# Altium project unisat_obc_hw.PrjPCB
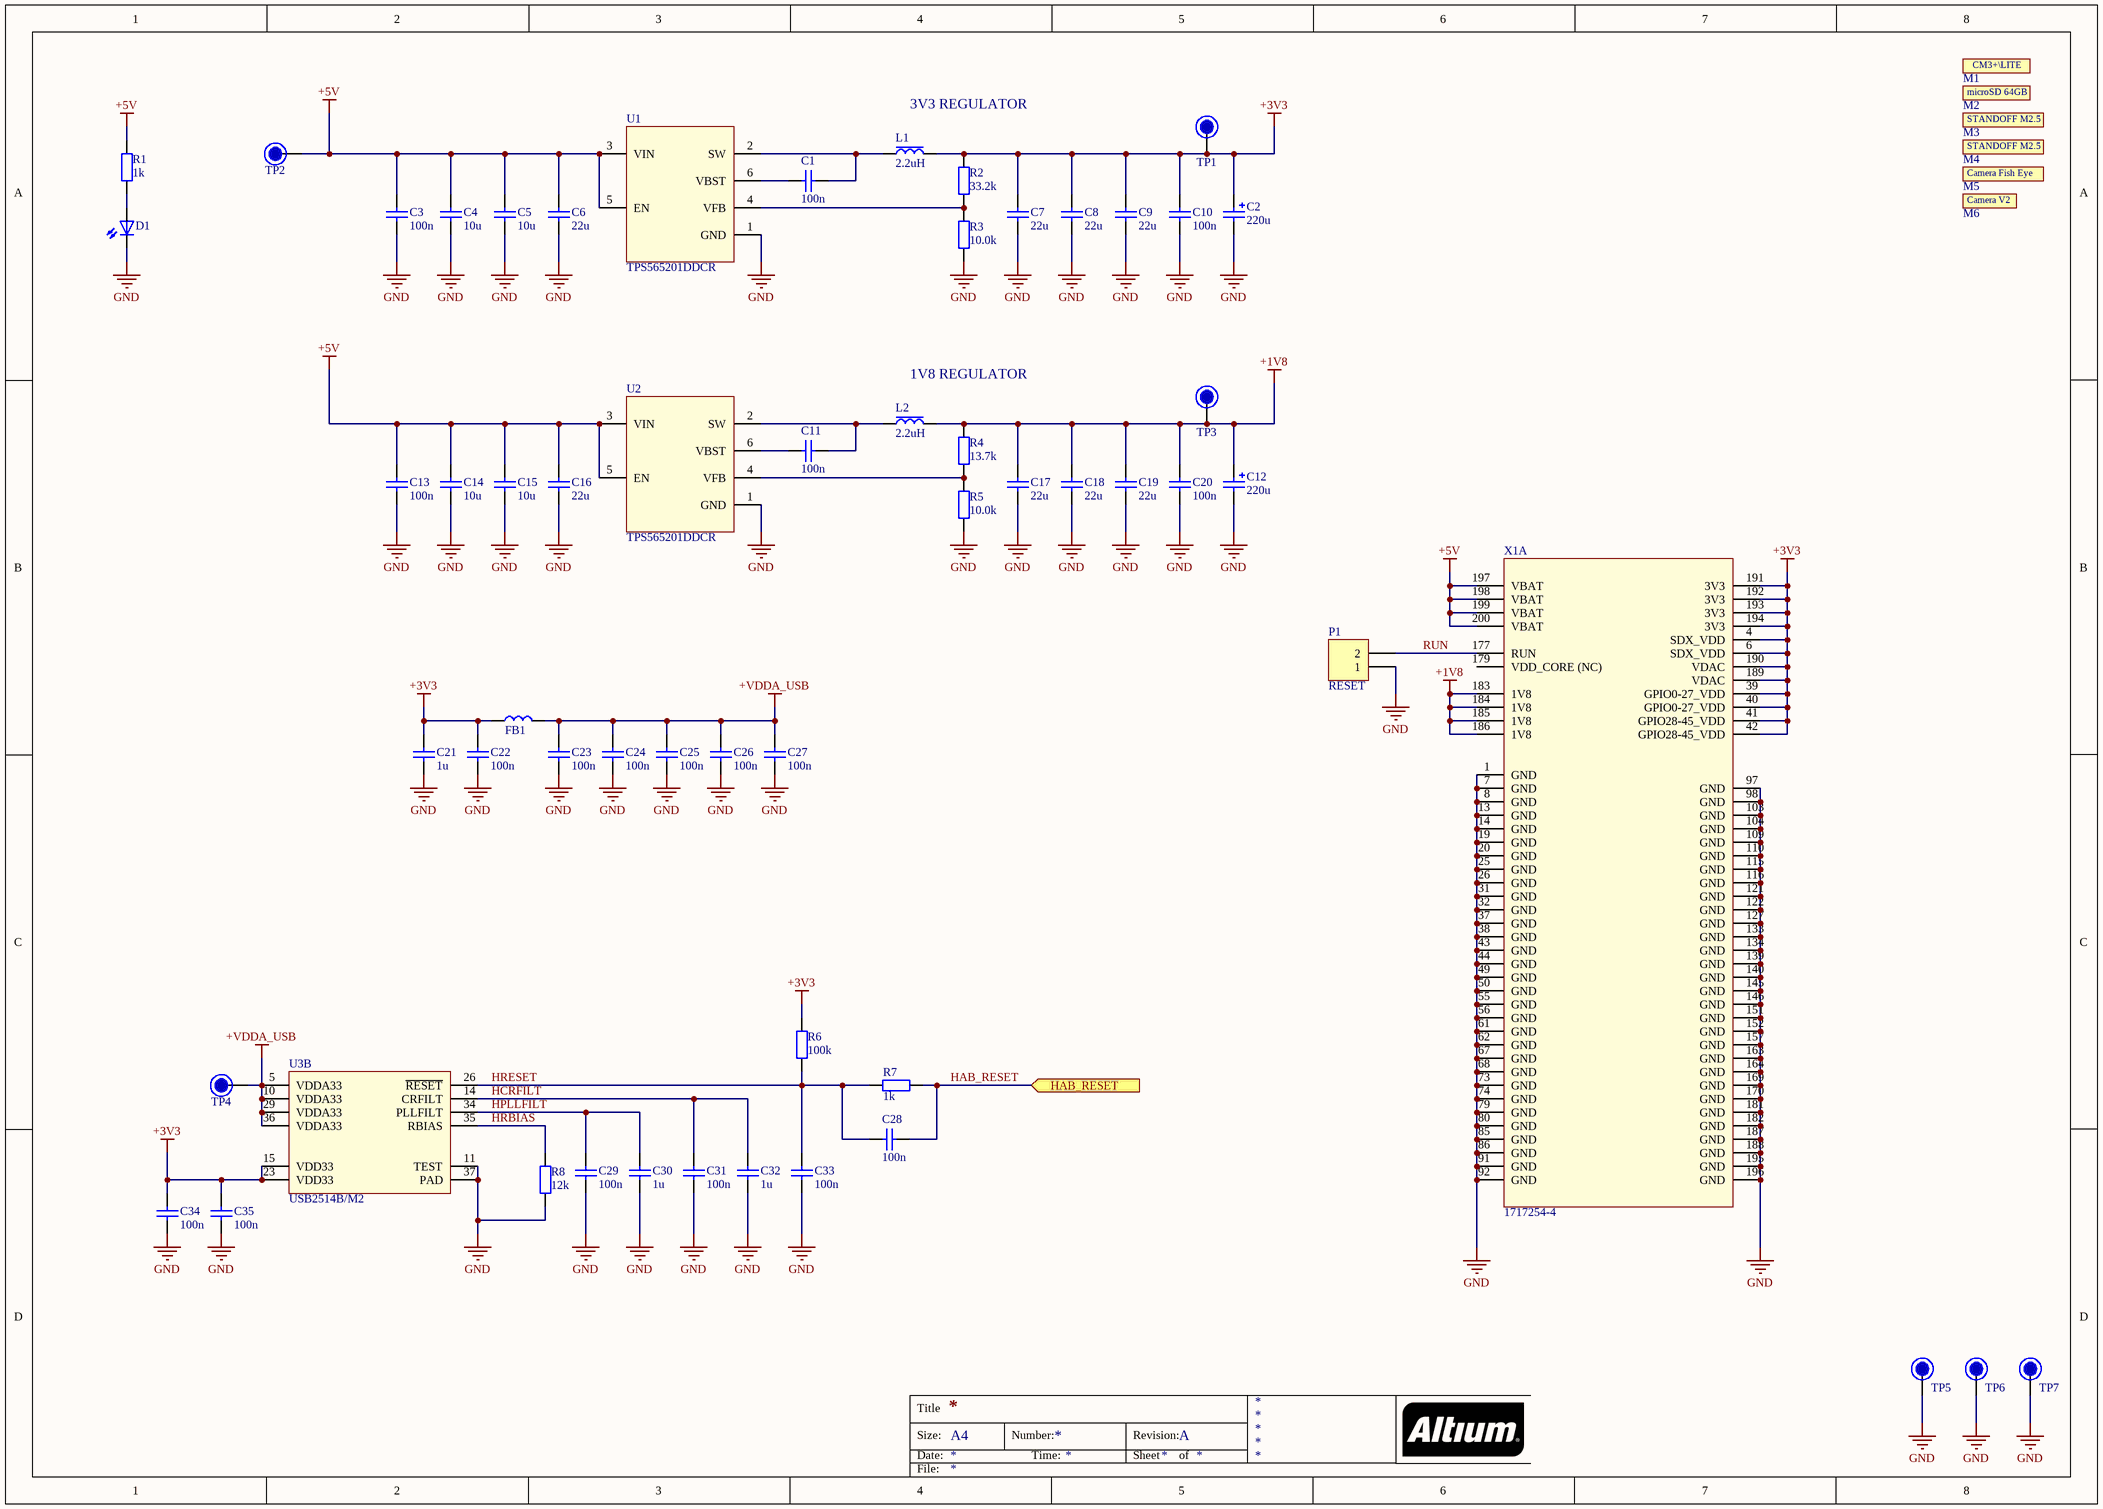
[diagram p0: 01_Power.SchDoc]
hwver: v03
8 sheets, 147 parts. Net scope: flat (ports and power ports of the same name join across sheets).
Board file: obc_board.PcbDoc
Sheets:
  01_Power.SchDoc
  02_RPI_IO.SchDoc
  03_RPI_VIDEO.SchDoc
  04_RPI_CAMERA.SchDoc
  05_RPI_STROAGE.SchDoc
  06_RPI_USB.SchDoc
  07_RS485.SchDoc
  08_AFBUS.SchDoc

## Sheet 01_Power.SchDoc
size A3; Revision: A

### Parts
C1  100n  [C0603_IPC_HD]
C2  220u  [TANT_CAP_7343]
C3  100n  [C0603_IPC_HD]
C4  10u  [C0805_IPC_HD]
C5  10u  [C0805_IPC_HD]
C6  22u  [C0805_IPC_HD]
C7  22u  [C0805_IPC_HD]
C8  22u  [C0805_IPC_HD]
C9  22u  [C0805_IPC_HD]
C10  100n  [C0603_IPC_HD]
C11  100n  [C0603_IPC_HD]
C12  220u  [TANT_CAP_7343]
C13  100n  [C0603_IPC_HD]
C14  10u  [C0805_IPC_HD]
C15  10u  [C0805_IPC_HD]
C16  22u  [C0805_IPC_HD]
C17  22u  [C0805_IPC_HD]
C18  22u  [C0805_IPC_HD]
C19  22u  [C0805_IPC_HD]
C20  100n  [C0603_IPC_HD]
C21  1u  [C0603_IPC_HD]
C22  100n  [C0603_IPC_HD]
C23  100n  [C0603_IPC_HD]
C24  100n  [C0603_IPC_HD]
C25  100n  [C0603_IPC_HD]
C26  100n  [C0603_IPC_HD]
C27  100n  [C0603_IPC_HD]
C28  100n  [C0603_IPC_HD]
C29  100n  [C0603_IPC_HD]
C30  1u  [C0603_IPC_HD]
C31  100n  [C0603_IPC_HD]
C32  1u  [C0603_IPC_HD]
C33  100n  [C0603_IPC_HD]
C34  100n  [C0603_IPC_HD]
C35  100n  [C0603_IPC_HD]
D1  LTST-C190GKT  [LED_0603]  (value not drawn)
FB1  MH1608-601Y  [L0603_IPC_MD]  (value not drawn)
L1  2.2uH  [ASPI-0520LR]
L2  2.2uH  [ASPI-0520LR]
M1  CM3+/LITE  (value not drawn)  (mechanical)
M2  SDCG2/­64GB  (value not drawn)  (mechanical)
M3  9774030151R  [9774030151R]  (value not drawn)
M4  9774030151R  [9774030151R]  (value not drawn)
M5  FishEye  (value not drawn)  (mechanical)
M6  913-2664  (value not drawn)  (mechanical)
P1  RESET  [HDR1X2]  (no BOM)
R1  1k  [R0603_IPC_MD]
R2  33.2k  [R0603_IPC_MD]
R3  10.0k  [R0603_IPC_MD]
R4  13.7k  [R0603_IPC_MD]
R5  10.0k  [R0603_IPC_MD]
R6  100k  [R0603_IPC_MD]
R7  1k  [R0603_IPC_MD]  (no BOM)
R8  12k  [R0603_IPC_MD]
TP1  3V3  [TestPoint_1M5]  (value not drawn)  (no BOM)
TP2  5V  [TestPoint_1M5]  (value not drawn)  (no BOM)
TP3  1V8  [TestPoint_1M5]  (value not drawn)  (no BOM)
TP4  VDDA_USB  [TestPoint_1M5]  (value not drawn)  (no BOM)
TP5  Test Point  [TestPoint_1M5_TH]  (value not drawn)  (no BOM)
TP6  Test Point  [TestPoint_1M5_TH]  (value not drawn)  (no BOM)
TP7  Test Point  [TestPoint_1M5_TH]  (value not drawn)  (no BOM)
U1  TPS565201DDCR  [SOT23-6_(TI)]
U2  TPS565201DDCR  [SOT23-6_(TI)]
U3  USB2514B/M2  [QFN36]  (part B of 2)
X1  1717254-4  [1717254-1]  (part A of 7)

### Ports
HAB_RESET (in)

### Nets
+1V8: C12.1 C17.1 C18.1 C19.1 C20.1 L2.2 R4.2 TP3.0 X1.183(1V8) X1.184(1V8) X1.185(1V8) X1.186(1V8)
+3V3: C2.1 C7.1 C8.1 C9.1 C10.1 C21.2 C22.2 C34.2 C35.2 FB1.1 L1.2 R2.2 R6.2 TP1.0 U3.15(VDD33) U3.23(VDD33) X1.4(SDX_VDD) X1.6(SDX_VDD) X1.39(GPIO0-27_VDD) X1.40(GPIO0-27_VDD) X1.41(GPIO28-45_VDD) X1.42(GPIO28-45_VDD) X1.189(VDAC) X1.190(VDAC) X1.191(3V3) X1.192(3V3) X1.193(3V3) X1.194(3V3)
+5V: C3.1 C4.2 C5.2 C6.1 C13.1 C14.2 C15.2 C16.1 R1.2 TP2.0 U1.3(VIN) U1.5(EN) U2.3(VIN) U2.5(EN) X1.197(VBAT) X1.198(VBAT) X1.199(VBAT) X1.200(VBAT)
+VDDA_USB: C23.2 C24.2 C25.2 C26.2 C27.2 FB1.2 TP4.0 U3.5(VDDA33) U3.10(VDDA33) U3.29(VDDA33) U3.36(VDDA33)
GND: C2.2 C3.2 C4.1 C5.1 C6.2 C7.2 C8.2 C9.2 C10.2 C12.2 C13.2 C14.1 C15.1 C16.2 C17.2 C18.2 C19.2 C20.2 C21.1 C22.1 C23.1 C24.1 C25.1 C26.1 C27.1 C29.1 C30.1 C31.1 C32.1 C33.2 C34.1 C35.1 D1.1(C) P1.1 R3.1 R5.1 R8.1 TP5.0 TP6.0 TP7.0 U1.1(GND) U2.1(GND) U3.11(TEST) U3.37(PAD) X1.1(GND) X1.7(GND) X1.8(GND) X1.13(GND) X1.14(GND) X1.19(GND) X1.20(GND) X1.25(GND) X1.26(GND) X1.31(GND) X1.32(GND) X1.37(GND) X1.38(GND) X1.43(GND) X1.44(GND) X1.49(GND) X1.50(GND) X1.55(GND) X1.56(GND) X1.61(GND) X1.62(GND) X1.67(GND) X1.68(GND) X1.73(GND) X1.74(GND) X1.79(GND) X1.80(GND) X1.85(GND) X1.86(GND) X1.91(GND) X1.92(GND) X1.97(GND) X1.98(GND) X1.103(GND) X1.104(GND) X1.109(GND) X1.110(GND) X1.115(GND) X1.116(GND) X1.121(GND) X1.122(GND) X1.127(GND) X1.133(GND) X1.134(GND) X1.139(GND) X1.140(GND) X1.145(GND) X1.146(GND) X1.151(GND) X1.152(GND) X1.157(GND) X1.163(GND) X1.164(GND) X1.169(GND) X1.170(GND) X1.181(GND) X1.182(GND) X1.187(GND) X1.188(GND) X1.195(GND) X1.196(GND)
HAB_RESET: C28.1 R7.1 ; port HAB_RESET
HCRFILT: C31.2 C32.2 U3.14(CRFILT)
HPLLFILT: C29.2 C30.2 U3.34(PLLFILT)
HRBIAS: R8.2 U3.35(RBIAS)
HRESET: C28.2 C33.1 R6.1 R7.2 U3.26(~{RESET})
RUN: P1.2 X1.177(RUN)
NetC1_1: C1.1 L1.1 U1.2(SW)
NetC1_2: C1.2 U1.6(VBST)
NetC11_1: C11.1 L2.1 U2.2(SW)
NetC11_2: C11.2 U2.6(VBST)
NetD1_2: D1.2(A) R1.1
NetR2_1: R2.1 R3.2 U1.4(VFB)
NetR4_1: R4.1 R5.2 U2.4(VFB)

Not connected (* = marked no-connect by the designer): X1 179(VDD_CORE_(NC))

### Notes on the sheet
- 3V3 REGULATOR
- 1V8 REGULATOR
- Title
- Size:
- Date:
- A4
- Number:
- Time:
- Revision:
- Sheet
- of
- File:
- (in symbol CM3+/LITE) CM3+\LITE
- (in symbol SDCG2/64GB) microSD 64GB
- (in symbol STANDOFF_M2.5X0.45_3MM) STANDOFF M2.5

### Library data of the parts
C1 C3 C10 C11 C13 C20 C22-C29 C31 C33-C35 = CL10B104KO8NNNC: CAP CER 0.1UF 16V X7R 0603; Manufacturer: Samsung Electro-Mechanics; Manufacturer Part Number: CL10B104KO8NNNC; Voltage: 16V; Value: 100n; Dielectric: X7R; Supplier 1: Digi-Key; Supplier Part Number 1: 1276-1005-1-ND
C2 C12 = 6TPE220MI: Tantalum Capacitors 220uF 6.3V CASE-D_7343 RoHS; Manufacturer: PANASONIC; Manufacturer Part Number: 6TPE220MI; Value: 220u; Voltage: 6.3V; Supplier 1: LCSC; Supplier Part Number 1: C129173
C4 C5 C14 C15 = CL21B106KOQNNNG: CAP CER 10UF 16V X7R 0805; Manufacturer: Samsung Electro-Mechanics; Manufacturer Part Number: CL21B106KOQNNNG; Voltage: 16V; Value: 10u; Dielectric: X7R; Supplier 1: Digi-Key; Supplier Part Number 1: 1276-6472-1-ND
C6-C9 C16-C19 = CL21A226MOCLRNC: CAP CER 22UF 16V X5R 0805; Manufacturer: Samsung Electro-Mechanics; Manufacturer Part Number: CL21A226MOCLRNC; Voltage: 16V; Value: 22u; Dielectric: X5R; Supplier 1: Digi-Key; Supplier Part Number 1: 1276-6780-1-ND
C21 C30 C32 = CL10B105MO8NNWC: CAP CER 1UF 16V X7R 0603; Manufacturer: Samsung Electro-Mechanics; Manufacturer Part Number: CL10B105MO8NNWC; Voltage: 16V; Value: 1u; Dielectric: X7R; Supplier 1: Digi-Key; Supplier Part Number 1: 1276-6524-1-ND
D1 = LTST-C190GKT: LED GREEN CLEAR CHIP SMD 0603; Manufacturer: Lite-On Inc.; Manufacturer Part Number: LTST-C190GKT; Color: Green; Supplier 1: Digi-Key; Supplier Part Number 1: 160-1183-1-ND
FB1 = MH1608-601Y: FERRITE BEAD 600R@100MHz 0603 for Power Line, 1000mA; Manufacturer: Bourns Inc.; Manufacturer Part Number: MH1608-601Y; Supplier 1: Digi-Key; Supplier Part Number 1: MH1608-601YCT-ND
L1 L2 = ASPI-0520LR-2R2M-T2: FIXED IND 2.2UH 5.5A 36 MOHM SMD; Manufacturer: Abracon LLC; Manufacturer Part Number: ASPI-0520LR-2R2M-T2; Value: 2.2uH; Supplier 1: Digi-Key; Supplier Part Number 1: ASPI-0520LR-2R2M-T2CT-ND
M1 = CM3+/LITE: RASPBERRY PI COMPUTE 3+ LITE; Manufacturer: Raspberry Pi; Manufacturer Part Number: CM3+/LITE; Supplier 1: Aliexpress; Supplier Part Number 1: CM3+/LITE
M2 = SDCG2/64GB: MemoryCard Class 10, 64GB; Manufacturer: Kingston; Manufacturer Part Number: SDCG2/­64GB; Supplier 1: Pulser; Supplier Part Number 1: 148836
M3 M4 = STANDOFF_M2.5X0.45_3MM: RND STANDOFF M2.5X0.45 STEEL 3MM; Manufacturer: Würth Elektronik; Manufacturer Part Number: 9774030151R; Supplier 1: Digi-Key; Supplier Part Number 1: 732-7083-1-ND; Link: https://www.digikey.com/product-detail/en/w%C3%BCrth-elektronik/9774030151R/732-7083-1-ND/5320688
M5 = Camera Fish Eye: RASPBERRY PI CAMERA MODULE V2; Manufacturer: China; Manufacturer Part Number: FishEye; Supplier 1: Aliexpress; Supplier Part Number 1: FishEye
M6 = Camera V2: RASPBERRY PI CAMERA MODULE V2; Manufacturer: Raspberry Pi; Manufacturer Part Number: 913-2664; Supplier 1: Digi-Key; Supplier Part Number 1: 1690-1011-ND
P1 = Header 2: Header, 2-Pin; LatestRevisionDate: 17-Jul-2002; LatestRevisionNote: Re-released for DXP Platform.; Publisher: Altium Limited
R1 R7 = CR0603-JW-102ELF: RES SMD 1K OHM 5% 1/10W 0603; Manufacturer: Bourns Inc.; Value: 1k; Tolarance: 5%; Manufacturer Part Number: CR0603-JW-102ELF; Supplier 1: Digi-Key; Supplier Part Number 1: CR0603-JW-102ELFCT-ND
R2 = RMCF0603FT33K2: RES 33.2K OHM 1% 1/10W 0603; Manufacturer: Stackpole Electronics Inc; Value: 33.2k; Tolarance: 1%; Manufacturer Part Number: RMCF0603FT33K2; Supplier 1: Digi-Key; Supplier Part Number 1: RMCF0603FT33K2CT-ND
R3 R5 = RMCF0603FT10K0: RES 10K OHM 1% 1/10W 0603; Manufacturer: Stackpole Electronics Inc; Value: 10.0k; Tolarance: 1%; Manufacturer Part Number: RMCF0603FT10K0; Supplier 1: Digi-Key; Supplier Part Number 1: RMCF0603FT10K0CT-ND
R4 = RMCF0603FT13K7: RES 13.7K OHM 1% 1/10W 0603; Manufacturer: Stackpole Electronics Inc; Value: 13.7k; Tolarance: 1%; Manufacturer Part Number: RMCF0603FT13K7; Supplier 1: Digi-Key; Supplier Part Number 1: RMCF0603FT13K7CT-ND
R6 = RMCF0603FT100K: RES 100K OHM 1% 1/10W 0603; Manufacturer: Bourns Inc.; Value: 100k; Tolarance: 1%; Manufacturer Part Number: RMCF0603FT100K; Supplier 1: Digi-Key; Supplier Part Number 1: RMCF0603FT100KCT-ND
R8 = CR0603-FX-1202ELF: RES SMD 12K OHM 1% 1/10W 0603; Manufacturer: Bourns Inc.; Value: 12k; Tolarance: 1%; Manufacturer Part Number: CR0603-FX-1202ELF; Supplier 1: Digi-Key; Supplier Part Number 1: CR0603-FX-1202ELFCT-ND
TP1-TP4 = TP: Test Point
TP5-TP7 = TP
U1 U2 = TPS565201DDCR: Buck Switching Regulator IC Positive Adjustable 0.76V 1 Output 5A SOT-23-6 Thin, TSOT-23-6; Manufacturer: TI; Manufacturer Part Number: TPS565201DDCR; Supplier 1: Digi-Key; Supplier Part Number 1: 296-49006-1-ND
U3 = USB2514B/M2: IC HUB CTLR 4PORT USB 2.0 HS 36S; Manufacturer: Microchip Technology; Manufacturer Part Number: USB2514B/M2; Supplier 1: Digi-Key; Supplier Part Number 1: USB2514B/M2-ND
X1 = Raspberry CM Connector: CONN SKT SODIMM 200POS R/A SMD; Manufacturer: TE Connectivity AMP Connectors; Manufacturer Part Number: 1717254-4; Supplier 1: Digi-Key; Supplier Part Number 1: A130932CT-ND

## Sheet 02_RPI_IO.SchDoc
size A4; Revision: A
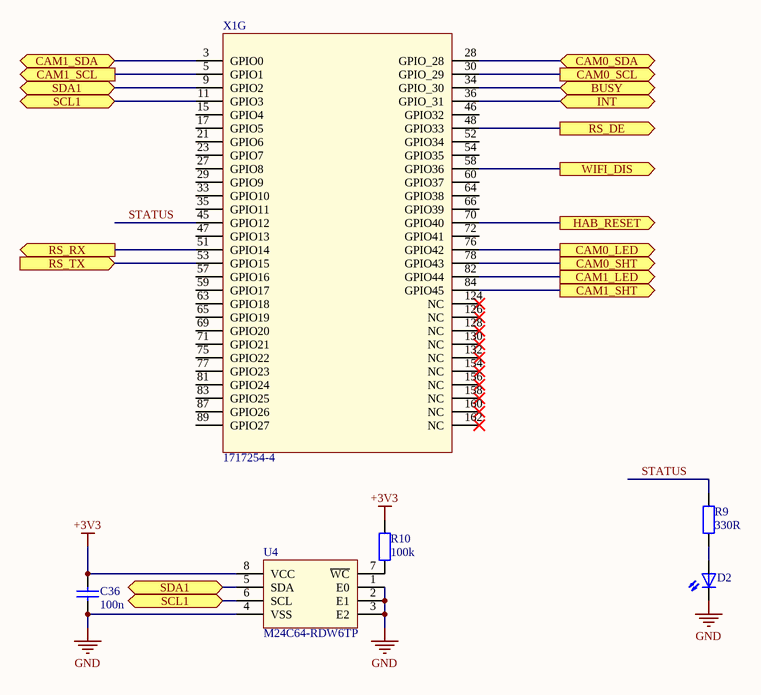
[diagram p1: 02_RPI_IO.SchDoc]

### Parts
C36  100n  [C0603_IPC_HD]
D2  LTST-C190GKT  [LED_0603]  (value not drawn)
R9  330R  [R0603_IPC_MD]
R10  100k  [R0603_IPC_MD]
U4  M24C64-RDW6TP  [TSSOP8_(ST)]
X1  1717254-4  [1717254-1]  (part G of 7)

### Ports
BUSY (bidir), CAM0_LED (out), CAM0_SCL (out), CAM0_SDA (bidir), CAM0_SHT (out), CAM1_LED (out), CAM1_SCL (out), CAM1_SDA (bidir), CAM1_SHT (out), HAB_RESET (out), INT (bidir), RS_DE (out), RS_RX (out), RS_TX (in), SCL1 (bidir), SDA1 (bidir), WIFI_DIS (out)

### Nets
+3V3: C36.2 R10.2 U4.8(VCC)
GND: C36.1 D2.1(C) U4.1(E0) U4.2(E1) U4.3(E2) U4.4(VSS)
AF_BUSY: X1.34(GPIO_30) ; port BUSY
AF_INT: X1.36(GPIO_31) ; port INT
AF_SCL: U4.6(SCL) X1.11(GPIO3) ; port SCL1
AF_SDA: U4.5(SDA) X1.9(GPIO2) ; port SDA1
CAM0_LED: X1.76(GPIO42) ; port CAM0_LED
CAM0_SCL: X1.30(GPIO_29) ; port CAM0_SCL
CAM0_SDA: X1.28(GPIO_28) ; port CAM0_SDA
CAM0_SHT: X1.78(GPIO43) ; port CAM0_SHT
CAM1_LED: X1.82(GPIO44) ; port CAM1_LED
CAM1_SCL: X1.5(GPIO1) ; port CAM1_SCL
CAM1_SDA: X1.3(GPIO0) ; port CAM1_SDA
CAM1_SHT: X1.84(GPIO45) ; port CAM1_SHT
HAB_RESET: X1.70(GPIO40) ; port HAB_RESET
STATUS: R9.2 X1.45(GPIO12)
WIFI_DIS: X1.58(GPIO36) ; port WIFI_DIS
NetD2_2: D2.2(A) R9.1
NetR10_1: R10.1 U4.7(~{WC})
NetR43_2: X1.48(GPIO33) ; port RS_DE
NetU9_1: X1.53(GPIO15) ; port RS_TX
NetU9_4: X1.51(GPIO14) ; port RS_RX

Not connected (* = marked no-connect by the designer): X1 15(GPIO4) 17(GPIO5) 21(GPIO6) 23(GPIO7) 27(GPIO8) 29(GPIO9) 33(GPIO10) 35(GPIO11) 46(GPIO32) 47(GPIO13) 52(GPIO34) 54(GPIO35) 57(GPIO16) 59(GPIO17) 60(GPIO37) 63(GPIO18) 64(GPIO38) 65(GPIO19) 66(GPIO39) 69(GPIO20) 71(GPIO21) 72(GPIO41) 75(GPIO22) 77(GPIO23) 81(GPIO24) 83(GPIO25) 87(GPIO26) 89(GPIO27) 124(NC)* 126(NC)* 128(NC)* 130(NC)* 132(NC)* 154(NC)* 156(NC)* 158(NC)* 160(NC)* 162(NC)*

### Notes on the sheet
- Title
- Size:
- Date:
- A4
- Number:
- Time:
- Revision:
- Sheet
- of
- File:

### Library data of the parts
C36 = CL10B104KO8NNNC: as C1 on sheet 01_Power; Manufacturer Part Number: CL10B104KO8NNNC; Voltage: 16V; Value: 100n; Dielectric: X7R; Supplier 1: Digi-Key; Supplier Part Number 1: 1276-1005-1-ND
D2 = LTST-C190GKT: as D1 on sheet 01_Power; Manufacturer Part Number: LTST-C190GKT; Color: Green; Supplier 1: Digi-Key; Supplier Part Number 1: 160-1183-1-ND
R9 = CR0603-JW-331ELF: RES SMD 330 OHM 5% 1/10W 0603; Manufacturer: Bourns Inc.; Value: 330R; Tolarance: 5%; Manufacturer Part Number: CR0603-JW-331ELF; Supplier 1: Digi-Key; Supplier Part Number 1: CR0603-JW-331ELFCT-ND
R10 = RMCF0603FT100K: as R6 on sheet 01_Power; Value: 100k; Tolarance: 1%; Manufacturer Part Number: RMCF0603FT100K; Supplier 1: Digi-Key; Supplier Part Number 1: RMCF0603FT100KCT-ND
U4 = M24C64-RDW6TP: IC EEPROM 64K I2C 1MHZ 8TSSOP; Manufacturer: STMicroelectronics; Manufacturer Part Number: M24C64-RDW6TP; Supplier 1: Digi-Key; Supplier Part Number 1: 497-8647-1-ND
X1 = Raspberry CM Connector: as X1 on sheet 01_Power; Manufacturer Part Number: 1717254-4; Supplier 1: Digi-Key; Supplier Part Number 1: A130932CT-ND

## Sheet 03_RPI_VIDEO.SchDoc
size A4; Revision: A
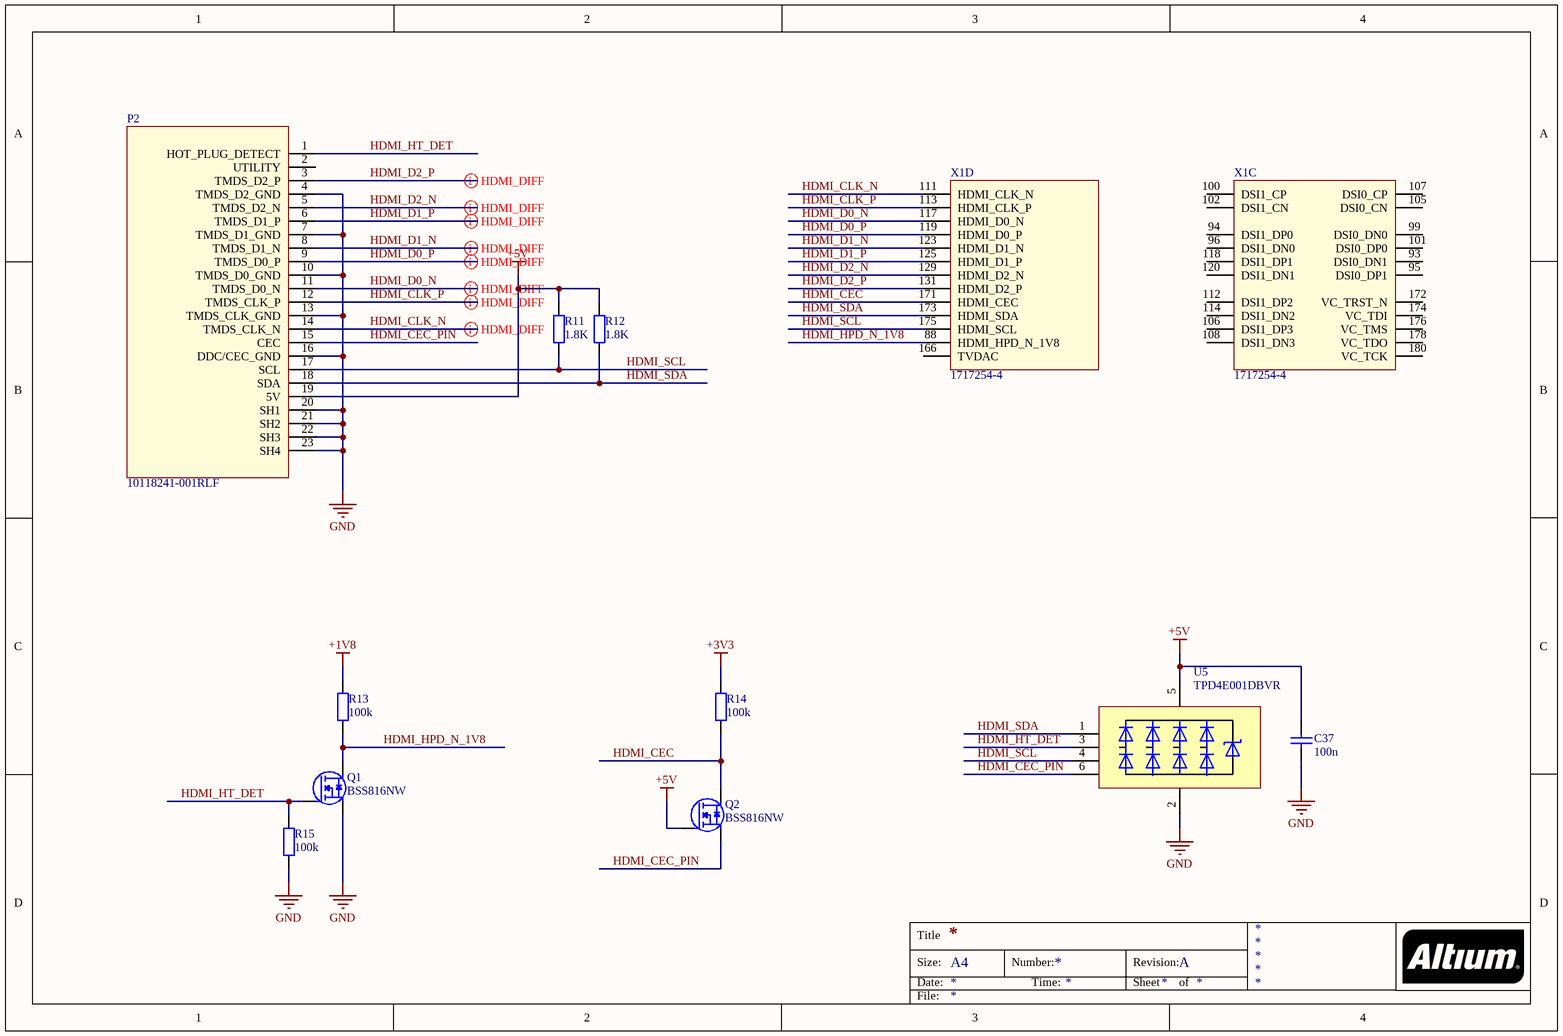
[diagram p2: 03_RPI_VIDEO.SchDoc]

### Parts
C37  100n  [C0603_IPC_HD]
P2  10118241-001RLF  [10118241-001RLF]
Q1  BSS816NW  [SOT323]
Q2  BSS816NW  [SOT323]
R11  1.8K  [R0603_IPC_MD]
R12  1.8K  [R0603_IPC_MD]
R13  100k  [R0603_IPC_MD]
R14  100k  [R0603_IPC_MD]
R15  100k  [R0603_IPC_MD]
U5  TPD4E001DBVR  [SOT23-6]
X1  1717254-4  [1717254-1]  (parts C,D of 7)

### Nets
+1V8: R13.2
+3V3: R14.2
+5V: C37.2 P2.19(5V) Q2.1(G) R11.2 R12.2 U5.5(VCC)
GND: C37.1 P2.4(TMDS_D2_GND) P2.7(TMDS_D1_GND) P2.10(TMDS_D0_GND) P2.13(TMDS_CLK_GND) P2.16(DDC/CEC_GND) P2.20(SH1) P2.21(SH2) P2.22(SH3) P2.23(SH4) Q1.2(S) R15.1 U5.2(GND)
HDMI_CEC: Q2.3(D) R14.1 X1.171(HDMI_CEC)
HDMI_CEC_PIN: P2.15(CEC) Q2.2(S) U5.6(IO4)
HDMI_CLK_N: P2.14(TMDS_CLK_N) X1.111(HDMI_CLK_N)
HDMI_CLK_P: P2.12(TMDS_CLK_P) X1.113(HDMI_CLK_P)
HDMI_D0_N: P2.11(TMDS_D0_N) X1.117(HDMI_D0_N)
HDMI_D0_P: P2.9(TMDS_D0_P) X1.119(HDMI_D0_P)
HDMI_D1_N: P2.8(TMDS_D1_N) X1.123(HDMI_D1_N)
HDMI_D1_P: P2.6(TMDS_D1_P) X1.125(HDMI_D1_P)
HDMI_D2_N: P2.5(TMDS_D2_N) X1.129(HDMI_D2_N)
HDMI_D2_P: P2.3(TMDS_D2_P) X1.131(HDMI_D2_P)
HDMI_HPD_N_1V8: Q1.3(D) R13.1 X1.88(HDMI_HPD_N_1V8)
HDMI_HT_DET: P2.1(HOT_PLUG_DETECT) Q1.1(G) R15.2 U5.3(IO2)
HDMI_SCL: P2.17(SCL) R11.1 U5.4(IO3) X1.175(HDMI_SCL)
HDMI_SDA: P2.18(SDA) R12.1 U5.1(IO1) X1.173(HDMI_SDA)

Not connected (* = marked no-connect by the designer): P2 2(UTILITY); X1 93(DSI0_DN1) 94(DSI1_DP0) 95(DSI0_DP1) 96(DSI1_DN0) 99(DSI0_DN0) 100(DSI1_CP) 101(DSI0_DP0) 102(DSI1_CN) 105(DSI0_CN) 106(DSI1_DP3) 107(DSI0_CP) 108(DSI1_DN3) 112(DSI1_DP2) 114(DSI1_DN2) 118(DSI1_DP1) 120(DSI1_DN1) 166(TVDAC) 172(VC_TRST_N) 174(VC_TDI) 176(VC_TMS) 178(VC_TDO) 180(VC_TCK)

### Layout directives
differential pair: HDMI_CLK_N, HDMI_CLK_P, HDMI_D0_N, HDMI_D0_P, HDMI_D1_N, HDMI_D1_P, HDMI_D2_N, HDMI_D2_P

### Notes on the sheet
- Title
- Size:
- Date:
- A4
- Number:
- Time:
- Revision:
- Sheet
- of
- File:

### Library data of the parts
C37 = CL10B104KO8NNNC: as C1 on sheet 01_Power; Manufacturer Part Number: CL10B104KO8NNNC; Voltage: 16V; Value: 100n; Dielectric: X7R; Supplier 1: Digi-Key; Supplier Part Number 1: 1276-1005-1-ND
P2 = 10118241-001RLF: CONN RCP MICRO HDMI 19POS SMD RA; Manufacturer: Amphenol ICC (FCI); Manufacturer Part Number: 10118241-001RLF; Supplier 1: Digi-Key; Supplier Part Number 1: 609-4615-1-ND
Q1 Q2 = BSS816: N-Channel Logic Level Enhancement Mode Field Effect Transistor; Manufacturer: Infineon Technologies; Manufacturer Part Number: BSS816NW; Supplier 1: Digi-Key; Supplier Part Number 1: BSS816NWH6327XTSA1CT-ND
R11 R12 = CR0603-JW-182ELF: RES SMD 1.8K OHM 5% 1/10W 0603; Manufacturer: Bourns Inc.; Value: 1.8K; Tolarance: 5%; Manufacturer Part Number: CR0603-JW-182ELF; Supplier 1: Digi-Key; Supplier Part Number 1: CR0603-JW-182ELFCT-ND
R13-R15 = RMCF0603FT100K: as R6 on sheet 01_Power; Value: 100k; Tolarance: 1%; Manufacturer Part Number: RMCF0603FT100K; Supplier 1: Digi-Key; Supplier Part Number 1: RMCF0603FT100KCT-ND
U5 = TPD4E001DBVR: 4x TVS DIODE 5.5V SOT23-6; Manufacturer: TI; Manufacturer Part Number: TPD4E001DBVR; Supplier 1: Digi-Key; Supplier Part Number 1: 296-28203-1-ND
X1 = Raspberry CM Connector: as X1 on sheet 01_Power; Manufacturer Part Number: 1717254-4; Supplier 1: Digi-Key; Supplier Part Number 1: A130932CT-ND

## Sheet 04_RPI_CAMERA.SchDoc
size A4; Revision: A
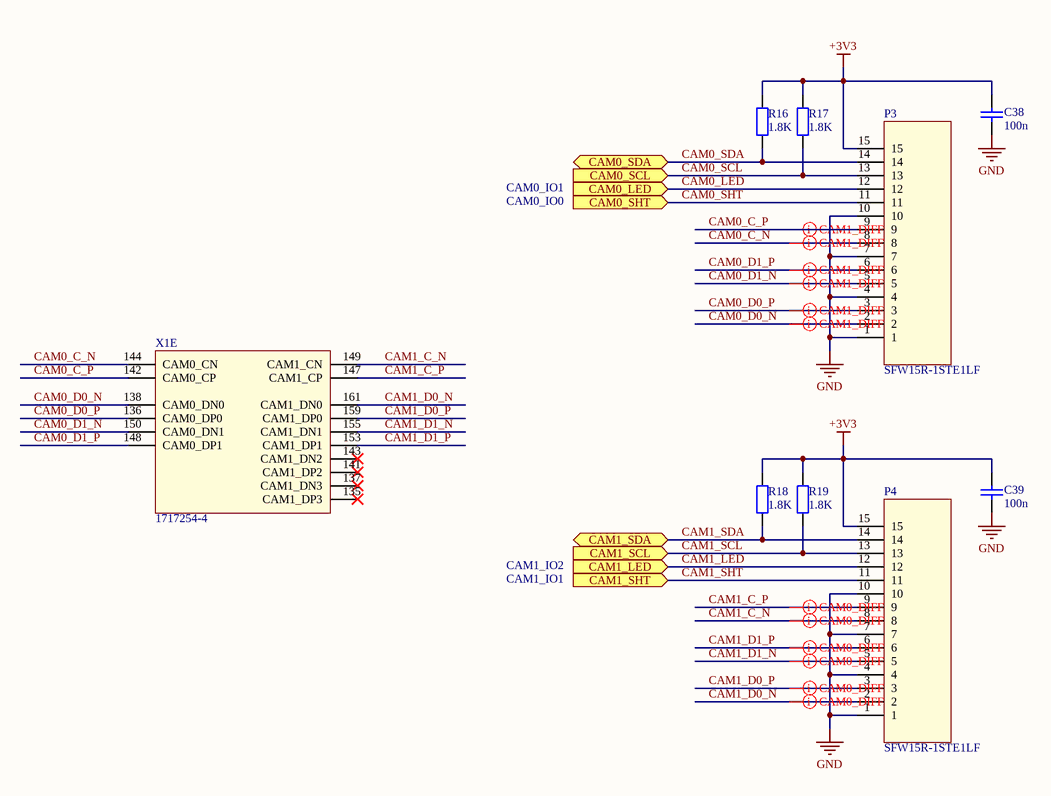
[diagram p3: 04_RPI_CAMERA.SchDoc]

### Parts
C38  100n  [C0603_IPC_HD]
C39  100n  [C0603_IPC_HD]
P3  SFW15R-1STE1LF  [SFW15R-1STE1LF]
P4  SFW15R-1STE1LF  [SFW15R-1STE1LF]
R16  1.8K  [R0603_IPC_MD]
R17  1.8K  [R0603_IPC_MD]
R18  1.8K  [R0603_IPC_MD]
R19  1.8K  [R0603_IPC_MD]
X1  1717254-4  [1717254-1]  (part E of 7)

### Ports
CAM0_LED (in), CAM0_SCL (in), CAM0_SDA (bidir), CAM0_SHT (in), CAM1_LED (in), CAM1_SCL (in), CAM1_SDA (bidir), CAM1_SHT (in)

### Nets
+3V3: C38.2 C39.2 P3.15 P4.15 R16.2 R17.2 R18.2 R19.2
GND: C38.1 C39.1 P3.1 P3.4 P3.7 P3.10 P4.1 P4.4 P4.7 P4.10
CAM0_C_N: P3.8 X1.144(CAM0_CN)
CAM0_C_P: P3.9 X1.142(CAM0_CP)
CAM0_D0_N: P3.2 X1.138(CAM0_DN0)
CAM0_D0_P: P3.3 X1.136(CAM0_DP0)
CAM0_D1_N: P3.5 X1.150(CAM0_DN1)
CAM0_D1_P: P3.6 X1.148(CAM0_DP1)
CAM0_LED: P3.12 ; port CAM0_LED
CAM0_SCL: P3.13 R17.1 ; port CAM0_SCL
CAM0_SDA: P3.14 R16.1 ; port CAM0_SDA
CAM0_SHT: P3.11 ; port CAM0_SHT
CAM1_C_N: P4.8 X1.149(CAM1_CN)
CAM1_C_P: P4.9 X1.147(CAM1_CP)
CAM1_D0_N: P4.2 X1.161(CAM1_DN0)
CAM1_D0_P: P4.3 X1.159(CAM1_DP0)
CAM1_D1_N: P4.5 X1.155(CAM1_DN1)
CAM1_D1_P: P4.6 X1.153(CAM1_DP1)
CAM1_LED: P4.12 ; port CAM1_LED
CAM1_SCL: P4.13 R19.1 ; port CAM1_SCL
CAM1_SDA: P4.14 R18.1 ; port CAM1_SDA
CAM1_SHT: P4.11 ; port CAM1_SHT

Not connected (* = marked no-connect by the designer): X1 135(CAM1_DP3)* 137(CAM1_DN3)* 141(CAM1_DP2)* 143(CAM1_DN2)*

### Layout directives
differential pair: CAM0_C_N, CAM0_C_P, CAM0_D0_N, CAM0_D0_P, CAM0_D1_N, CAM0_D1_P, CAM1_C_N, CAM1_C_P, CAM1_D0_N, CAM1_D0_P, CAM1_D1_N, CAM1_D1_P

### Notes on the sheet
- CAM0_IO0
- CAM0_IO1
- CAM1_IO1
- CAM1_IO2
- Title
- Size:
- Date:
- A4
- Number:
- Time:
- Revision:
- Sheet
- of
- File:

### Library data of the parts
C38 C39 = CL10B104KO8NNNC: as C1 on sheet 01_Power; Manufacturer Part Number: CL10B104KO8NNNC; Voltage: 16V; Value: 100n; Dielectric: X7R; Supplier 1: Digi-Key; Supplier Part Number 1: 1276-1005-1-ND
P3 P4 = SFW15R-1STE1LF: CONN FFC BOTTOM 15POS 1.00MM R/A; Manufacturer: Amphenol ICC (FCI); Manufacturer Part Number: SFW15R-1STE1LF; Supplier 1: Digi-Key; Supplier Part Number 1: 609-1905-1-ND
R16-R19 = CR0603-JW-182ELF: as R11 on sheet 03_RPI_VIDEO; Value: 1.8K; Tolarance: 5%; Manufacturer Part Number: CR0603-JW-182ELF; Supplier 1: Digi-Key; Supplier Part Number 1: CR0603-JW-182ELFCT-ND
X1 = Raspberry CM Connector: as X1 on sheet 01_Power; Manufacturer Part Number: 1717254-4; Supplier 1: Digi-Key; Supplier Part Number 1: A130932CT-ND

## Sheet 05_RPI_STROAGE.SchDoc
size A4; Revision: A
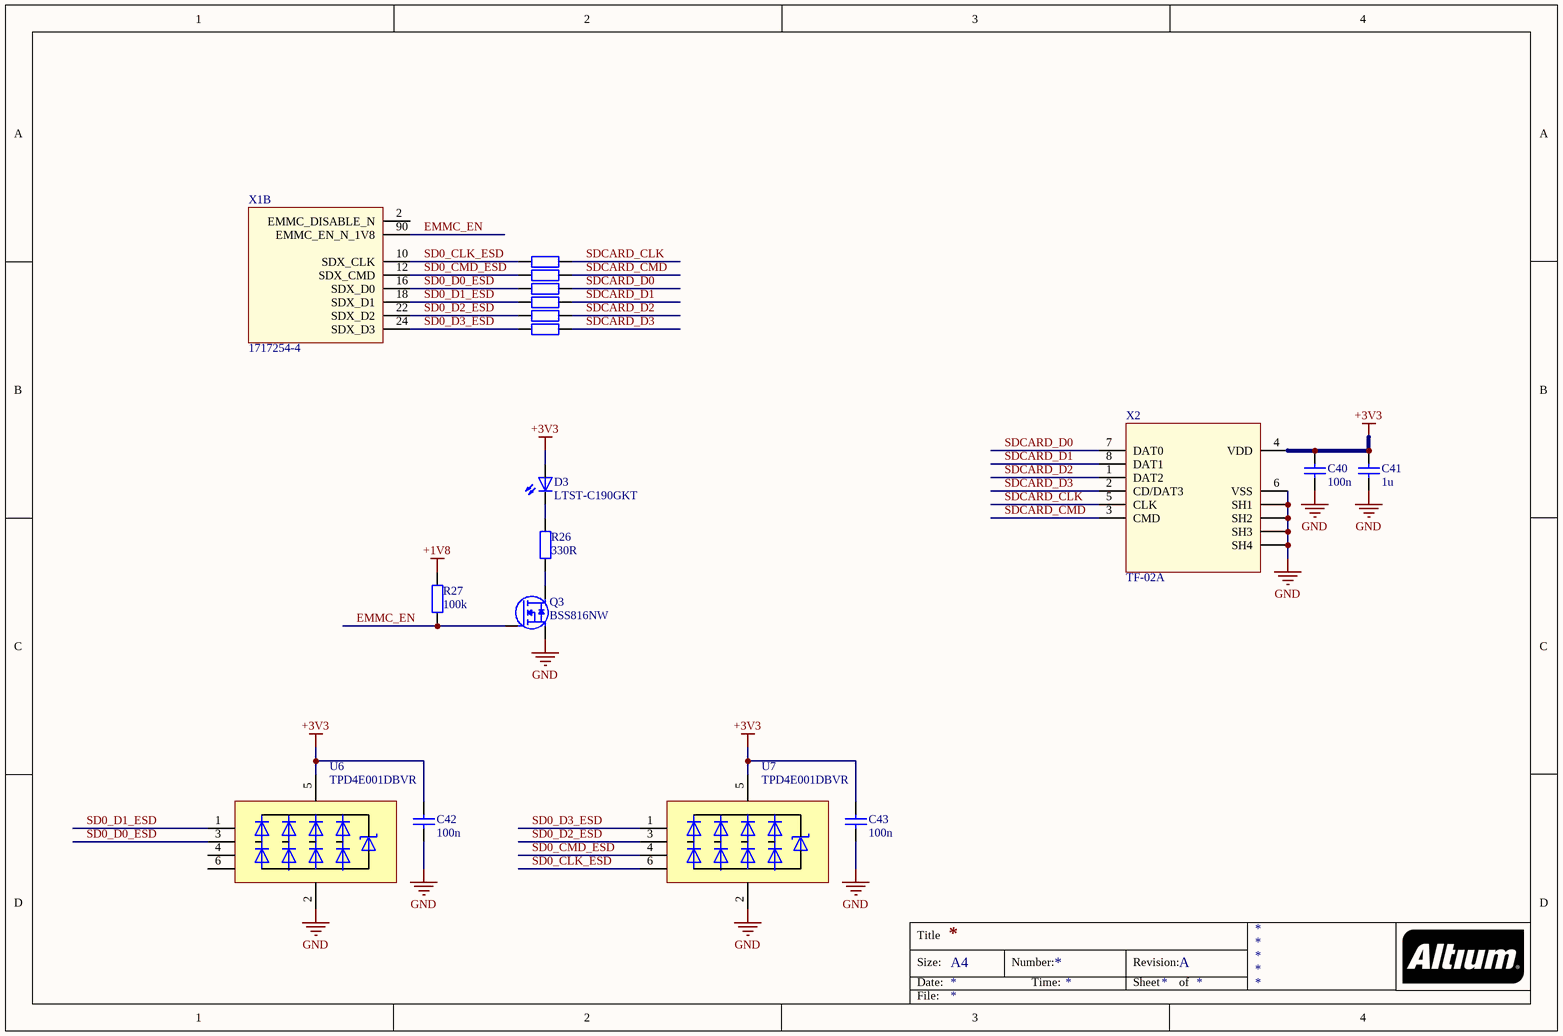
[diagram p4: 05_RPI_STROAGE.SchDoc]

### Parts
C40  100n  [C0603_IPC_HD]
C41  1u  [C0603_IPC_HD]
C42  100n  [C0603_IPC_HD]
C43  100n  [C0603_IPC_HD]
D3  LTST-C190GKT  [LED_0603]
Q3  BSS816NW  [SOT323]
R20  22R  [R0603_IPC_MD]  (value not drawn)
R21  22R  [R0603_IPC_MD]  (value not drawn)
R22  22R  [R0603_IPC_MD]  (value not drawn)
R23  22R  [R0603_IPC_MD]  (value not drawn)
R24  22R  [R0603_IPC_MD]  (value not drawn)
R25  22R  [R0603_IPC_MD]  (value not drawn)
R26  330R  [R0603_IPC_MD]
R27  100k  [R0603_IPC_MD]
U6  TPD4E001DBVR  [SOT23-6]
U7  TPD4E001DBVR  [SOT23-6]
X1  1717254-4  [1717254-1]  (part B of 7)
X2  TF-02A  [TF-02A]

### Nets
+1V8: R27.2
+3V3: C40.2 C41.2 C42.2 C43.2 D3.2(A) U6.5(VCC) U7.5(VCC) X2.4(VDD)
GND: C40.1 C41.1 C42.1 C43.1 Q3.2(S) U6.2(GND) U7.2(GND) X2.6(VSS) X2.9(SH1) X2.10(SH2) X2.11(SH3) X2.12(SH4)
EMMC_EN: Q3.1(G) R27.1 X1.90(EMMC_EN_N_1V8)
SD0_CLK_ESD: R20.1 U7.6(IO4) X1.10(SDX_CLK)
SD0_CMD_ESD: R21.1 U7.4(IO3) X1.12(SDX_CMD)
SD0_D0_ESD: R22.1 U6.3(IO2) X1.16(SDX_D0)
SD0_D1_ESD: R23.1 U6.1(IO1) X1.18(SDX_D1)
SD0_D2_ESD: R24.1 U7.3(IO2) X1.22(SDX_D2)
SD0_D3_ESD: R25.1 U7.1(IO1) X1.24(SDX_D3)
SDCARD_CLK: R20.2 X2.5(CLK)
SDCARD_CMD: R21.2 X2.3(CMD)
SDCARD_D0: R22.2 X2.7(DAT0)
SDCARD_D1: R23.2 X2.8(DAT1)
SDCARD_D2: R24.2 X2.1(DAT2)
SDCARD_D3: R25.2 X2.2(CD/DAT3)
NetD3_1: D3.1(C) R26.2
NetQ3_3: Q3.3(D) R26.1

Not connected (* = marked no-connect by the designer): U6 4(IO3) 6(IO4); X1 2(EMMC_DISABLE_N)

### Notes on the sheet
- Title
- Size:
- Date:
- A4
- Number:
- Time:
- Revision:
- Sheet
- of
- File:

### Library data of the parts
C40 C42 C43 = CL10B104KO8NNNC: as C1 on sheet 01_Power; Manufacturer Part Number: CL10B104KO8NNNC; Voltage: 16V; Value: 100n; Dielectric: X7R; Supplier 1: Digi-Key; Supplier Part Number 1: 1276-1005-1-ND
C41 = CL10B105MO8NNWC: as C21 on sheet 01_Power; Manufacturer Part Number: CL10B105MO8NNWC; Voltage: 16V; Value: 1u; Dielectric: X7R; Supplier 1: Digi-Key; Supplier Part Number 1: 1276-6524-1-ND
D3 = LTST-C190GKT: as D1 on sheet 01_Power; Manufacturer Part Number: LTST-C190GKT; Color: Green; Supplier 1: Digi-Key; Supplier Part Number 1: 160-1183-1-ND
Q3 = BSS816: as Q1 on sheet 03_RPI_VIDEO; Manufacturer Part Number: BSS816NW; Supplier 1: Digi-Key; Supplier Part Number 1: BSS816NWH6327XTSA1CT-ND
R20-R25 = CR0603-JW-220ELF: RES SMD 22 OHM 5% 1/10W 0603; Manufacturer: Bourns Inc.; Value: 22R; Tolarance: 5%; Manufacturer Part Number: CR0603-JW-220ELF; Supplier 1: Digi-Key; Supplier Part Number 1: CR0603-JW-220ELFCT-ND
R26 = CR0603-JW-331ELF: as R9 on sheet 02_RPI_IO; Value: 330R; Tolarance: 5%; Manufacturer Part Number: CR0603-JW-331ELF; Supplier 1: Digi-Key; Supplier Part Number 1: CR0603-JW-331ELFCT-ND
R27 = RMCF0603FT100K: as R6 on sheet 01_Power; Value: 100k; Tolarance: 1%; Manufacturer Part Number: RMCF0603FT100K; Supplier 1: Digi-Key; Supplier Part Number 1: RMCF0603FT100KCT-ND
U6 U7 = TPD4E001DBVR: as U5 on sheet 03_RPI_VIDEO; Manufacturer Part Number: TPD4E001DBVR; Supplier 1: Digi-Key; Supplier Part Number 1: 296-28203-1-ND
X1 = Raspberry CM Connector: as X1 on sheet 01_Power; Manufacturer Part Number: 1717254-4; Supplier 1: Digi-Key; Supplier Part Number 1: A130932CT-ND
X2 = TF-02A: CONN MICRO SD CARD; Manufacturer: Korean Hroparts Elec; Manufacturer Part Number: TF-02A; Supplier 1: LCSC; Supplier Part Number 1: C105419

## Sheet 06_RPI_USB.SchDoc
size A3; Revision: A
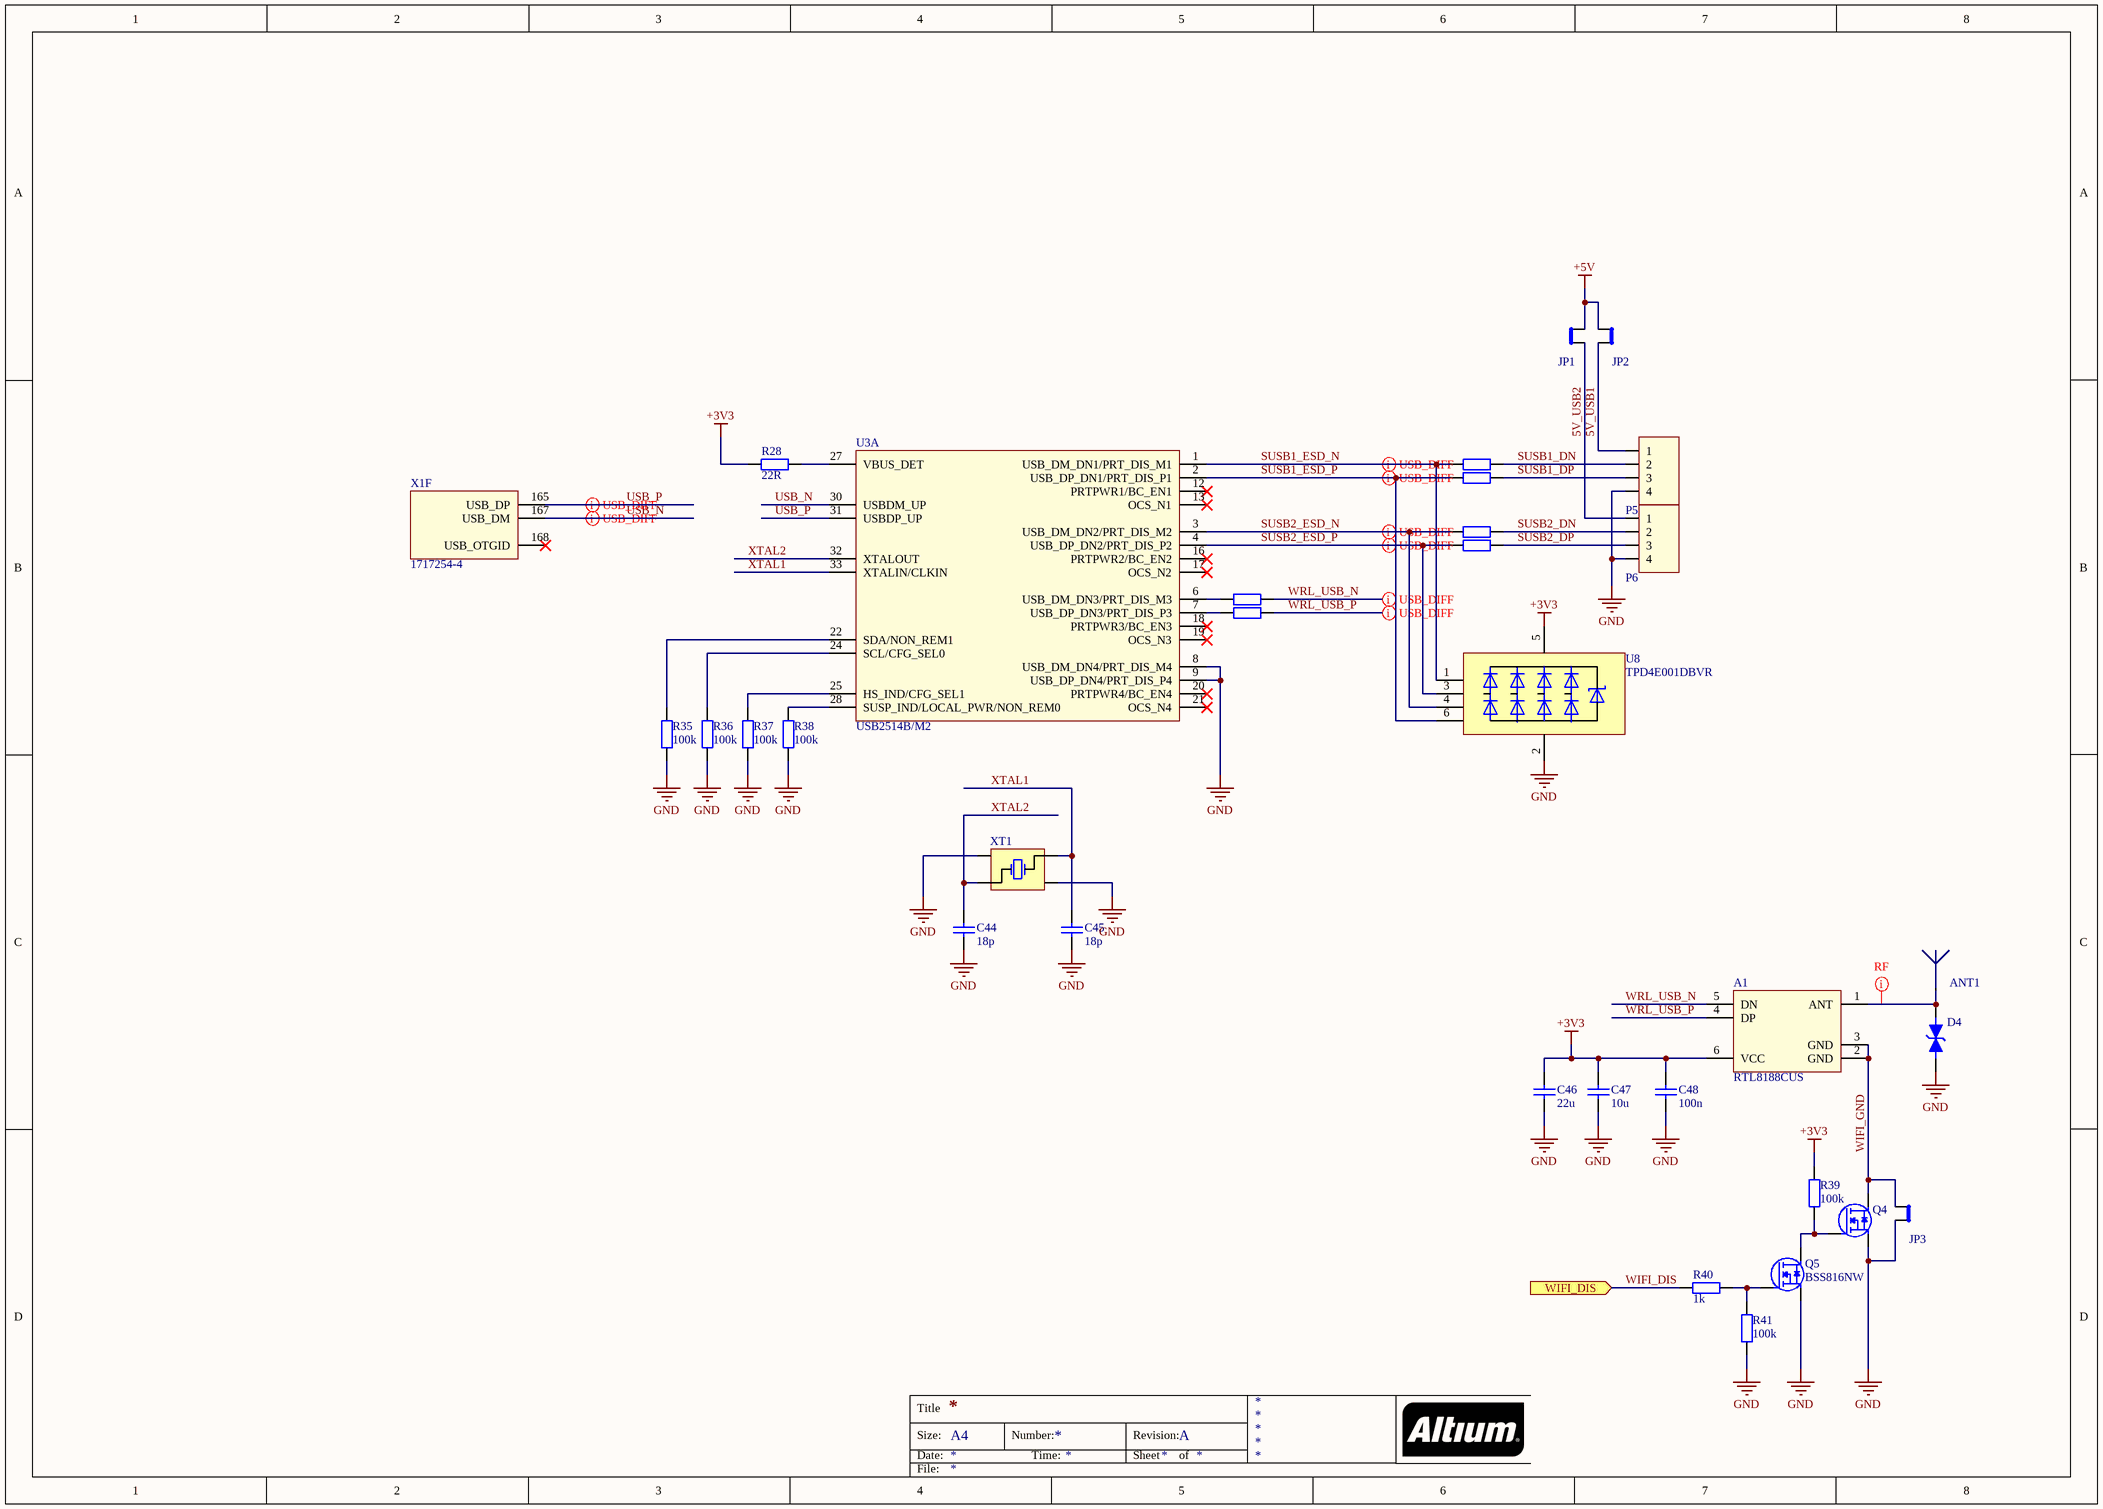
[diagram p5: 06_RPI_USB.SchDoc]

### Parts
A1  RTL8188CUS  [RTL8188]
ANT1  ANT7020LL05R2400A  [ANT7020LL05]  (value not drawn)
C44  18p  [C0603_IPC_HD]
C45  18p  [C0603_IPC_HD]
C46  22u  [C0805_IPC_HD]
C47  10u  [C0805_IPC_HD]
C48  100n  [C0603_IPC_HD]
D4  LXES15AAA1-153  [C0402_IPC_MD]  (value not drawn)
JP1  Jumper  [SolderHump1]  (value not drawn)  (no BOM)
JP2  Jumper  [SolderHump1]  (value not drawn)  (no BOM)
JP3  Jumper  [SolderHump1]  (value not drawn)  (no BOM)
P5  PicoBlade_4R  [PB_53261-0471_Right]  (value not drawn)
P6  PicoBlade_4R  [PB_53261-0471_Right]  (value not drawn)
Q4  DMG2302UK-7  [SOT23]  (value not drawn)
Q5  BSS816NW  [SOT323]
R28  22R  [R0603_IPC_MD]
R29  22R  [R0603_IPC_MD]  (value not drawn)
R30  22R  [R0603_IPC_MD]  (value not drawn)
R31  22R  [R0603_IPC_MD]  (value not drawn)
R32  22R  [R0603_IPC_MD]  (value not drawn)
R33  22R  [R0603_IPC_MD]  (value not drawn)
R34  22R  [R0603_IPC_MD]  (value not drawn)
R35  100k  [R0603_IPC_MD]
R36  100k  [R0603_IPC_MD]
R37  100k  [R0603_IPC_MD]
R38  100k  [R0603_IPC_MD]
R39  100k  [R0603_IPC_MD]
R40  1k  [R0603_IPC_MD]
R41  100k  [R0603_IPC_MD]
U3  USB2514B/M2  [QFN36]  (part A of 2)
U8  TPD4E001DBVR  [SOT23-6]
X1  1717254-4  [1717254-1]  (part F of 7)
XT1  TSX-3225-24.0000MF15X-AC6  [3.2x2.5_4pad_smd]  (value not drawn)

### Ports
WIFI_DIS (in)

### Nets
+3V3: A1.6(VCC) C46.1 C47.2 C48.2 R28.1 R39.2 U8.5(VCC)
+5V: JP1.2 JP2.2
GND: C44.1 C45.1 C46.2 C47.1 C48.1 D4.1 JP3.1 P5.4 P6.4 Q4.2(S) Q5.2(S) R35.1 R36.1 R37.1 R38.1 R41.1 U3.8(USB_DM_DN4/PRT_DIS_M4) U3.9(USB_DP_DN4/PRT_DIS_P4) U8.2(GND) XT1.2(NC) XT1.4(NC)
5V_USB1: JP2.1 P5.1
5V_USB2: JP1.1 P6.1
SUSB1_DN: P5.2 R29.2
SUSB1_DP: P5.3 R30.2
SUSB1_ESD_N: R29.1 U3.1(USB_DM_DN1/PRT_DIS_M1) U8.1(IO1)
SUSB1_ESD_P: R30.1 U3.2(USB_DP_DN1/PRT_DIS_P1) U8.6(IO4)
SUSB2_DN: P6.2 R31.2
SUSB2_DP: P6.3 R32.2
SUSB2_ESD_N: R31.1 U3.3(USB_DM_DN2/PRT_DIS_M2) U8.4(IO3)
SUSB2_ESD_P: R32.1 U3.4(USB_DP_DN2/PRT_DIS_P2) U8.3(IO2)
USB_N: U3.30(USBDM_UP) X1.167(USB_DM)
USB_P: U3.31(USBDP_UP) X1.165(USB_DP)
WIFI_DIS: R40.1 ; port WIFI_DIS
WIFI_GND: A1.2(GND) A1.3(GND) JP3.2 Q4.3(D)
WRL_USB_N: A1.5(DN) R33.2
WRL_USB_P: A1.4(DP) R34.2
XTAL1: C45.2 U3.33(XTALIN/CLKIN) XT1.1(OSC1)
XTAL2: C44.2 U3.32(XTALOUT) XT1.3(OSC2)
NetA1_1: A1.1(ANT) ANT1.1 D4.2
NetQ4_1: Q4.1(G) Q5.3(D) R39.1
NetQ5_1: Q5.1(G) R40.2 R41.2
NetR28_2: R28.2 U3.27(VBUS_DET)
NetR33_1: R33.1 U3.6(USB_DM_DN3/PRT_DIS_M3)
NetR34_1: R34.1 U3.7(USB_DP_DN3/PRT_DIS_P3)
NetR35_2: R35.2 U3.22(SDA/NON_REM1)
NetR36_2: R36.2 U3.24(SCL/CFG_SEL0)
NetR37_2: R37.2 U3.25(HS_IND/CFG_SEL1)
NetR38_2: R38.2 U3.28(SUSP_IND/LOCAL_PWR/NON_REM0)

Not connected (* = marked no-connect by the designer): U3 12(PRTPWR1/BC_EN1)* 13(OCS_N1)* 16(PRTPWR2/BC_EN2)* 17(OCS_N2)* 18(PRTPWR3/BC_EN3)* 19(OCS_N3)* 20(PRTPWR4/BC_EN4)* 21(OCS_N4)*; X1 168(USB_OTGID)*

### Layout directives
net class RF: NetA1_1
differential pair: SUSB1_ESD_N, SUSB1_ESD_P, SUSB2_ESD_N, SUSB2_ESD_P, USB_N, USB_P, WRL_USB_N, WRL_USB_P

### Notes on the sheet
- Title
- Size:
- Date:
- A4
- Number:
- Time:
- Revision:
- Sheet
- of
- File:

### Library data of the parts
A1 = RTL8188CUS: USB WiFi module; Manufacturer: China; Manufacturer Part Number: RTL8188CUS; Supplier 1: Aliexpress; Supplier Part Number 1: RTL8188CUS
ANT1 = ANT7020LL05R2400A: RF ANT 2.4GHZ CHIP SOLDER SMD; Manufacturer: Yageo; Manufacturer Part Number: ANT7020LL05R2400A; Supplier 1: Digi-Key; Supplier Part Number 1: 311-1549-1-ND
C44 C45 = CL10C180JB8NNNC: CAP CER 18PF 50V C0G/NP0 0603; Manufacturer: Samsung Electro-Mechanics; Manufacturer Part Number: CL10C180JB8NNNC; Voltage: 50V; Value: 18p; Dielectric: C0G/NP0; Supplier 1: Digi-Key; Supplier Part Number 1: 1276-1089-1-ND
C46 = CL21A226MOCLRNC: as C6 on sheet 01_Power; Manufacturer Part Number: CL21A226MOCLRNC; Voltage: 16V; Value: 22u; Dielectric: X5R; Supplier 1: Digi-Key; Supplier Part Number 1: 1276-6780-1-ND
C47 = CL21B106KOQNNNG: as C4 on sheet 01_Power; Manufacturer Part Number: CL21B106KOQNNNG; Voltage: 16V; Value: 10u; Dielectric: X7R; Supplier 1: Digi-Key; Supplier Part Number 1: 1276-6472-1-ND
C48 = CL10B104KO8NNNC: as C1 on sheet 01_Power; Manufacturer Part Number: CL10B104KO8NNNC; Voltage: 16V; Value: 100n; Dielectric: X7R; Supplier 1: Digi-Key; Supplier Part Number 1: 1276-1005-1-ND
D4 = LXES15AAA1-153: TVS DIODE 4V 0402; Manufacturer: Murata Electronics North America; Manufacturer Part Number: LXES15AAA1-153; Voltage - Reverse Standoff (Typ): 4V; Supplier 1: Digi-Key; Supplier Part Number 1: 490-13210-1-ND
JP1-JP3 = Jumper: Jumper 2.54mm 1 pos; Manufacturer: *; Manufacturer Part Number: *
P5 P6 = PicoBlade_4R: Connector Header Surface Mount 4 position 0.049" (1.25mm); Manufacturer: China; Manufacturer Part Number: PicoBlade_4R; Supplier 1: Aliexpress; Supplier Part Number 1: PicoBlade_4R
Q4 = DMG2302: N-Channel Logic Level Enhancement Mode Field Effect Transistor; Manufacturer: Diodes Incorporated; Manufacturer Part Number: DMG2302UK-7; Supplier 1: Digi-Key; Supplier Part Number 1: DMG2302UK-7DICT-ND
Q5 = BSS816: as Q1 on sheet 03_RPI_VIDEO; Manufacturer Part Number: BSS816NW; Supplier 1: Digi-Key; Supplier Part Number 1: BSS816NWH6327XTSA1CT-ND
R28-R34 = CR0603-JW-220ELF: as R20 on sheet 05_RPI_STROAGE; Value: 22R; Tolarance: 5%; Manufacturer Part Number: CR0603-JW-220ELF; Supplier 1: Digi-Key; Supplier Part Number 1: CR0603-JW-220ELFCT-ND
R35-R39 R41 = RMCF0603FT100K: as R6 on sheet 01_Power; Value: 100k; Tolarance: 1%; Manufacturer Part Number: RMCF0603FT100K; Supplier 1: Digi-Key; Supplier Part Number 1: RMCF0603FT100KCT-ND
R40 = CR0603-JW-102ELF: as R1 on sheet 01_Power; Value: 1k; Tolarance: 5%; Manufacturer Part Number: CR0603-JW-102ELF; Supplier 1: Digi-Key; Supplier Part Number 1: CR0603-JW-102ELFCT-ND
U3 = USB2514B/M2: as U3 on sheet 01_Power; Manufacturer Part Number: USB2514B/M2; Supplier 1: Digi-Key; Supplier Part Number 1: USB2514B/M2-ND
U8 = TPD4E001DBVR: as U5 on sheet 03_RPI_VIDEO; Manufacturer Part Number: TPD4E001DBVR; Supplier 1: Digi-Key; Supplier Part Number 1: 296-28203-1-ND
X1 = Raspberry CM Connector: as X1 on sheet 01_Power; Manufacturer Part Number: 1717254-4; Supplier 1: Digi-Key; Supplier Part Number 1: A130932CT-ND
XT1 = TSX-3225-24.0000MF15X-AC61: CRYSTAL 24.00 MHZ 9.0PF SMD; Manufacturer: EPSON; Value: 24 MHz; Manufacturer Part Number: TSX-3225-24.0000MF15X-AC6; Supplier 1: Digi-Key; Supplier Part Number 1: SER4180CT-ND

## Sheet 07_RS485.SchDoc
size A4; Revision: A
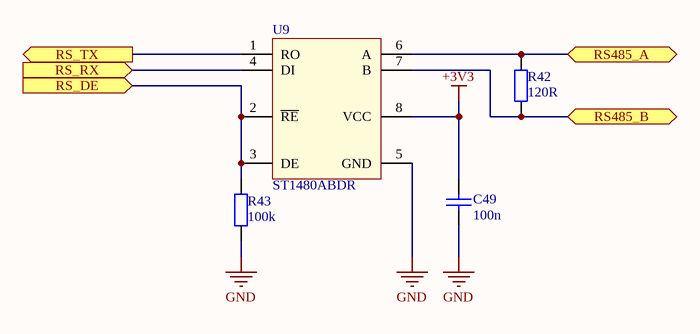
[diagram p6: 07_RS485.SchDoc]

### Parts
C49  100n  [C0603_IPC_HD]
R42  120R  [R0603_IPC_MD]
R43  100k  [R0603_IPC_MD]
U9  ST1480ABDR  [SOIC-8]

### Ports
RS485_A (bidir), RS485_B (bidir), RS_DE (in), RS_RX (in), RS_TX (out)

### Nets
+3V3: C49.2 U9.8(VCC)
GND: C49.1 R43.1 U9.5(GND)
RS485A: R42.2 U9.6(A) ; port RS485_A
RS485B: R42.1 U9.7(B) ; port RS485_B
NetR43_2: R43.2 U9.2(~{RE}) U9.3(DE) ; port RS_DE
NetU9_1: U9.1(RO) ; port RS_TX
NetU9_4: U9.4(DI) ; port RS_RX

### Notes on the sheet
- Title
- Size:
- Date:
- A4
- Number:
- Time:
- Revision:
- Sheet
- of
- File:

### Library data of the parts
C49 = CL10B104KO8NNNC: as C1 on sheet 01_Power; Manufacturer Part Number: CL10B104KO8NNNC; Voltage: 16V; Value: 100n; Dielectric: X7R; Supplier 1: Digi-Key; Supplier Part Number 1: 1276-1005-1-ND
R42 = RC0603JR-07120RL: RES SMD 120 OHM 5% 1/10W 0603; Manufacturer: Yageo; Value: 120R; Tolarance: 5%; Manufacturer Part Number: RC0603JR-07120RL; Supplier 1: Digi-Key; Supplier Part Number 1: 311-120GRCT-ND
R43 = RMCF0603FT100K: as R6 on sheet 01_Power; Value: 100k; Tolarance: 1%; Manufacturer Part Number: RMCF0603FT100K; Supplier 1: Digi-Key; Supplier Part Number 1: RMCF0603FT100KCT-ND
U9 = ST1480ABDR: IC TXRX 3.3V RS485/422 8 SOIC; Manufacturer: STMicroelectronics; Manufacturer Part Number: ST1480ABDR; Supplier 1: Digi-Key; Supplier Part Number 1: 497-2046-1-ND

## Sheet 08_AFBUS.SchDoc
size A4; Revision: A
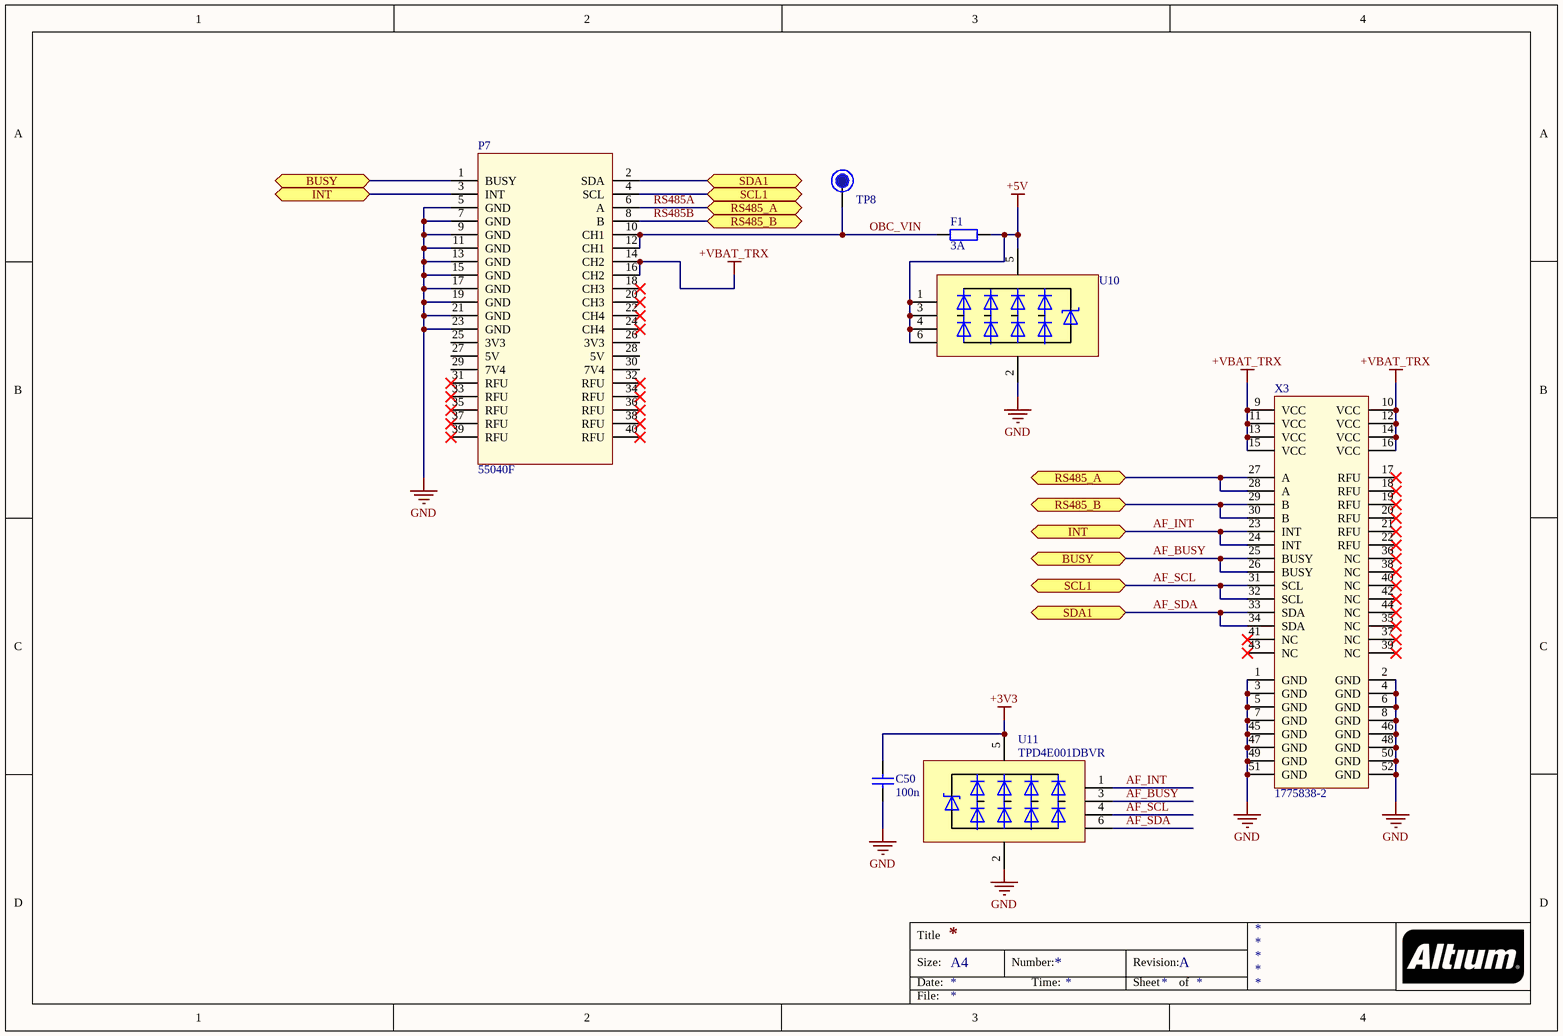
[diagram p7: 08_AFBUS.SchDoc]

### Parts
C50  100n  [C0603_IPC_HD]
F1  3A  [F0603_IPC_MD]
P7  55040F  [HEADER_40PIN_12MM2]
TP8  VIN  [TestPoint_1M5]  (value not drawn)  (no BOM)
U10  TPD4E001DBVR  [SOT23-6]  (value not drawn)
U11  TPD4E001DBVR  [SOT23-6]
X3  1775838-2  [1775838-2]

### Ports
BUSY (bidir), INT (bidir), RS485_A (bidir), RS485_B (bidir), SCL1 (bidir), SDA1 (bidir)

### Nets
+3V3: C50.2 U11.5(VCC)
+5V: F1.2 U10.1(IO1) U10.3(IO2) U10.4(IO3) U10.5(VCC) U10.6(IO4)
+VBAT_TRX: P7.14(CH2) P7.16(CH2) X3.9(VCC) X3.10(VCC) X3.11(VCC) X3.12(VCC) X3.13(VCC) X3.14(VCC) X3.15(VCC) X3.16(VCC)
GND: C50.1 P7.5(GND) P7.7(GND) P7.9(GND) P7.11(GND) P7.13(GND) P7.15(GND) P7.17(GND) P7.19(GND) P7.21(GND) P7.23(GND) U10.2(GND) U11.2(GND) X3.1(GND) X3.2(GND) X3.3(GND) X3.4(GND) X3.5(GND) X3.6(GND) X3.7(GND) X3.8(GND) X3.45(GND) X3.46(GND) X3.47(GND) X3.48(GND) X3.49(GND) X3.50(GND) X3.51(GND) X3.52(GND)
AF_BUSY: P7.1(BUSY) U11.3(IO2) X3.25(BUSY) X3.26(BUSY) ; port BUSY
AF_INT: P7.3(INT) U11.1(IO1) X3.23(INT) X3.24(INT) ; port INT
AF_SCL: P7.4(SCL) U11.4(IO3) X3.31(SCL) X3.32(SCL) ; port SCL1
AF_SDA: P7.2(SDA) U11.6(IO4) X3.33(SDA) X3.34(SDA) ; port SDA1
OBC_VIN: F1.1 P7.10(CH1) P7.12(CH1) TP8.0
RS485A: P7.6(A) X3.27(A) X3.28(A) ; port RS485_A
RS485B: P7.8(B) X3.29(B) X3.30(B) ; port RS485_B

Not connected (* = marked no-connect by the designer): P7 18(CH3)* 20(CH3)* 22(CH4)* 24(CH4)* 25(3V3) 26(3V3) 27(5V) 28(5V) 29(7V4) 30(7V4) 31(RFU)* 32(RFU)* 33(RFU)* 34(RFU)* 35(RFU)* 36(RFU)* 37(RFU)* 38(RFU)* 39(RFU)* 40(RFU)*; X3 17(RFU)* 18(RFU)* 19(RFU)* 20(RFU)* 21(RFU)* 22(RFU)* 35(NC)* 36(NC)* 37(NC)* 38(NC)* 39(NC)* 40(NC)* 41(NC)* 42(NC)* 43(NC)* 44(NC)*

### Notes on the sheet
- Title
- Size:
- Date:
- A4
- Number:
- Time:
- Revision:
- Sheet
- of
- File:

### Library data of the parts
C50 = CL10B104KO8NNNC: as C1 on sheet 01_Power; Manufacturer Part Number: CL10B104KO8NNNC; Voltage: 16V; Value: 100n; Dielectric: X7R; Supplier 1: Digi-Key; Supplier Part Number 1: 1276-1005-1-ND
F1 = C2Q3: FUSE BRD MNT 3A 32VAC 63VDC 0603; Manufacturer: Bel Fuse Inc.; Value: 3A; Manufacturer Part Number: C2Q3; Supplier 1: Digi-Key; Supplier Part Number 1: 507-1096-1-ND
P7 = ALFASAT_BIC: CONN HEADER R/A 40POS 2.54MM; Manufacturer: On Shore Technology Inc.; Manufacturer Part Number: 55040F; Supplier 1: LCSC; Supplier Part Number 1: C35165
TP8 = TP: Test Point
U10 U11 = TPD4E001DBVR: as U5 on sheet 03_RPI_VIDEO; Manufacturer Part Number: TPD4E001DBVR; Supplier 1: Digi-Key; Supplier Part Number 1: 296-28203-1-ND
X3 = ALAFASAT_TRX_PCI: CONN PCI EXP MINI FEMALE 52POS; Manufacturer: TE Connectivity AMP Connectors; Manufacturer Part Number: 1775838-2; Supplier 1: Digi-Key; Supplier Part Number 1: A123340CT-ND

## Nets that join several sheets
+1V8: 01_Power (12 pins), 03_RPI_VIDEO (R13.2), 05_RPI_STROAGE (R27.2)
+3V3: 01_Power (28 pins), 02_RPI_IO (C36.2 R10.2 U4.8), 03_RPI_VIDEO (R14.2), 04_RPI_CAMERA (8 pins), 05_RPI_STROAGE (8 pins), 06_RPI_USB (7 pins), 07_RS485 (C49.2 U9.8), 08_AFBUS (C50.2 U11.5)
+5V: 01_Power (18 pins), 03_RPI_VIDEO (6 pins), 06_RPI_USB (JP1.2 JP2.2), 08_AFBUS (6 pins)
GND: 01_Power (105 pins), 02_RPI_IO (6 pins), 03_RPI_VIDEO (13 pins), 04_RPI_CAMERA (10 pins), 05_RPI_STROAGE (12 pins), 06_RPI_USB (21 pins), 07_RS485 (C49.1 R43.1 U9.5), 08_AFBUS (29 pins)
AF_BUSY: 02_RPI_IO (X1.34), 08_AFBUS (P7.1 U11.3 X3.25 X3.26)
AF_INT: 02_RPI_IO (X1.36), 08_AFBUS (P7.3 U11.1 X3.23 X3.24)
AF_SCL: 02_RPI_IO (U4.6 X1.11), 08_AFBUS (P7.4 U11.4 X3.31 X3.32)
AF_SDA: 02_RPI_IO (U4.5 X1.9), 08_AFBUS (P7.2 U11.6 X3.33 X3.34)
CAM0_LED: 02_RPI_IO (X1.76), 04_RPI_CAMERA (P3.12)
CAM0_SCL: 02_RPI_IO (X1.30), 04_RPI_CAMERA (P3.13 R17.1)
CAM0_SDA: 02_RPI_IO (X1.28), 04_RPI_CAMERA (P3.14 R16.1)
CAM0_SHT: 02_RPI_IO (X1.78), 04_RPI_CAMERA (P3.11)
CAM1_LED: 02_RPI_IO (X1.82), 04_RPI_CAMERA (P4.12)
CAM1_SCL: 02_RPI_IO (X1.5), 04_RPI_CAMERA (P4.13 R19.1)
CAM1_SDA: 02_RPI_IO (X1.3), 04_RPI_CAMERA (P4.14 R18.1)
CAM1_SHT: 02_RPI_IO (X1.84), 04_RPI_CAMERA (P4.11)
HAB_RESET: 01_Power (C28.1 R7.1), 02_RPI_IO (X1.70)
NetR43_2: 02_RPI_IO (X1.48), 07_RS485 (R43.2 U9.2 U9.3)
NetU9_1: 02_RPI_IO (X1.53), 07_RS485 (U9.1)
NetU9_4: 02_RPI_IO (X1.51), 07_RS485 (U9.4)
RS485A: 07_RS485 (R42.2 U9.6), 08_AFBUS (P7.6 X3.27 X3.28)
RS485B: 07_RS485 (R42.1 U9.7), 08_AFBUS (P7.8 X3.29 X3.30)
WIFI_DIS: 02_RPI_IO (X1.58), 06_RPI_USB (R40.1)